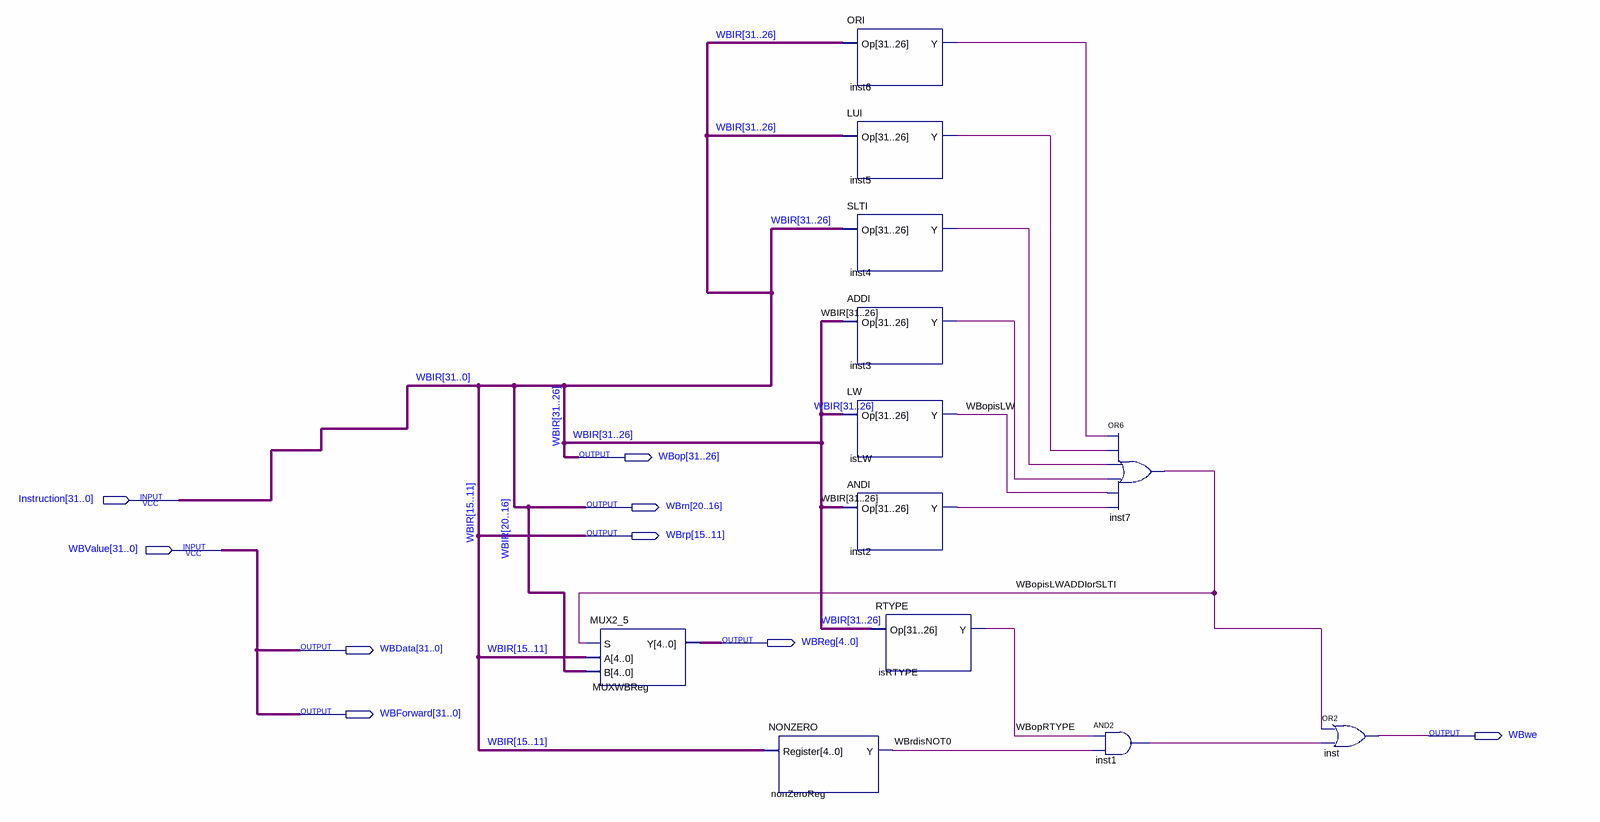
[diagram p0: schematic sheet]
// Quartus schematic WB.bdf as structural Verilog: 12 symbols, 9 pins
module WB (
  input  [31:0] Instruction,
  input  [31:0] WBValue,
  output [31:26] WBop,
  output [20:16] WBrn,
  output [15:11] WBrp,
  output [4:0] WBReg,
  output [31:0] WBData,
  output [31:0] WBForward,
  output WBwe
);

  wire inst1_out, inst2_y, inst3_y, inst4_y, inst5_y, inst6_y, WBopisLW, WBopisLWADDIorSLTI, WBopRTYPE,
       WBrdisNOT0;

  MUX2_5 MUXWBReg (.S(WBopisLWADDIorSLTI), .A(Instruction[15:11]), .B(Instruction[20:16]), .Y(WBReg));
  NONZERO nonZeroReg (.Register(Instruction[15:11]), .Y(WBrdisNOT0));
  ORI inst6 (.Op(Instruction[31:26]), .Y(inst6_y));
  LUI inst5 (.Op(Instruction[31:26]), .Y(inst5_y));
  SLTI inst4 (.Op(Instruction[31:26]), .Y(inst4_y));
  ADDI inst3 (.Op(Instruction[31:26]), .Y(inst3_y));
  LW isLW (.Op(Instruction[31:26]), .Y(WBopisLW));
  ANDI inst2 (.Op(Instruction[31:26]), .Y(inst2_y));
  RTYPE isRTYPE (.Op(Instruction[31:26]), .Y(WBopRTYPE));
  and inst1 (inst1_out, WBopRTYPE, WBrdisNOT0);
  or inst7 (WBopisLWADDIorSLTI, inst6_y, inst5_y, inst4_y, inst3_y, WBopisLW, inst2_y);
  or inst (WBwe, WBopisLWADDIorSLTI, inst1_out);

  assign WBData = WBValue;
  assign WBForward = WBValue;
  assign WBop = Instruction[31:26];
  assign WBrn = Instruction[20:16];
  assign WBrp = Instruction[15:11];

  // Other names for the same wires on the sheet: WBIR[31:0] = Instruction
endmodule
